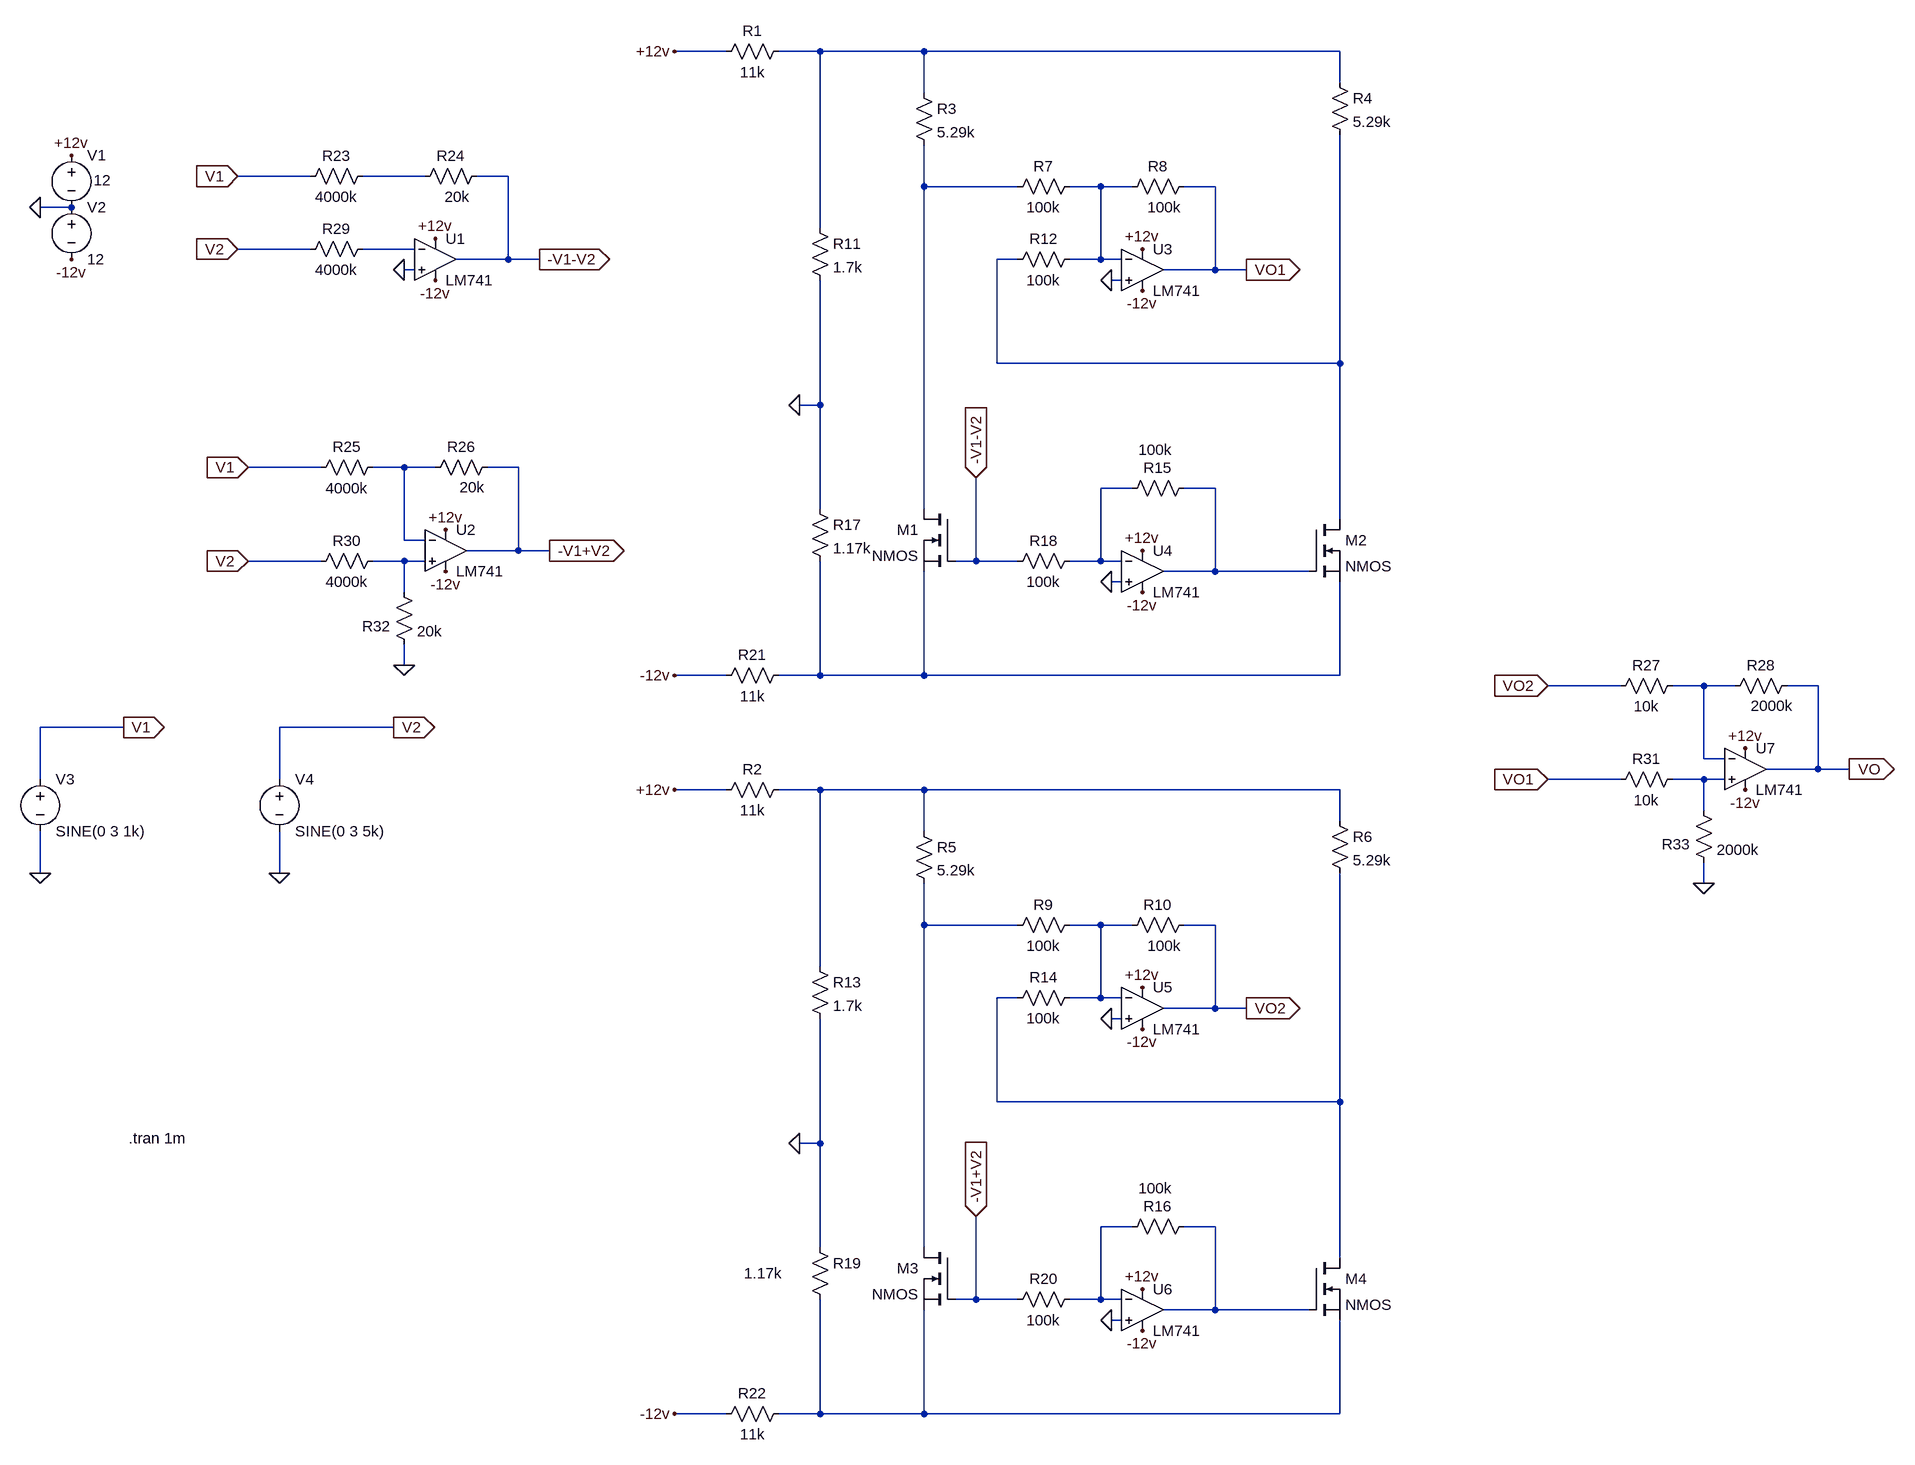
[diagram p0: schematic Multiplier_squaring.asc]
Multiplier_squaring.asc, the LTspice schematic file:
Version 4
SHEET 1 2468 1968
WIRE 592 -208 512 -208
WIRE 736 -208 672 -208
WIRE 896 -208 736 -208
WIRE 1536 -208 896 -208
WIRE 1536 -160 1536 -208
WIRE 896 -144 896 -208
WIRE -48 -16 -160 -16
WIRE 128 -16 32 -16
WIRE 256 -16 208 -16
WIRE 896 0 896 -64
WIRE 1040 0 896 0
WIRE 1168 0 1120 0
WIRE 1216 0 1168 0
WIRE 1344 0 1296 0
WIRE -416 32 -464 32
WIRE 736 64 736 -208
WIRE -48 96 -160 96
WIRE 112 96 32 96
WIRE 256 112 256 -16
WIRE 256 112 176 112
WIRE 304 112 256 112
WIRE 1040 112 1008 112
WIRE 1168 112 1168 0
WIRE 1168 112 1120 112
WIRE 1200 112 1168 112
WIRE 112 128 96 128
WIRE 1344 128 1344 0
WIRE 1344 128 1264 128
WIRE 1392 128 1344 128
WIRE 1200 144 1184 144
WIRE 1008 272 1008 112
WIRE 1536 272 1536 -80
WIRE 1536 272 1008 272
WIRE 736 336 736 144
WIRE 736 336 704 336
WIRE -32 432 -144 432
WIRE 96 432 48 432
WIRE 144 432 96 432
WIRE 272 432 224 432
WIRE 1216 464 1168 464
WIRE 1344 464 1296 464
WIRE 736 496 736 336
WIRE 896 496 896 0
WIRE 1536 512 1536 272
WIRE 96 544 96 432
WIRE 128 544 96 544
WIRE 272 560 272 432
WIRE 272 560 192 560
WIRE 320 560 272 560
WIRE -32 576 -144 576
WIRE 96 576 48 576
WIRE 128 576 96 576
WIRE 976 576 976 448
WIRE 976 576 944 576
WIRE 1040 576 976 576
WIRE 1168 576 1168 464
WIRE 1168 576 1120 576
WIRE 1200 576 1168 576
WIRE 1344 592 1344 464
WIRE 1344 592 1264 592
WIRE 1488 592 1344 592
WIRE 1200 608 1184 608
WIRE 96 624 96 576
WIRE 96 736 96 704
WIRE 592 752 512 752
WIRE 736 752 736 576
WIRE 736 752 672 752
WIRE 896 752 896 592
WIRE 896 752 736 752
WIRE 1536 752 1536 608
WIRE 1536 752 896 752
WIRE 1968 768 1856 768
WIRE 2096 768 2048 768
WIRE 2144 768 2096 768
WIRE 2272 768 2224 768
WIRE -336 832 -464 832
WIRE 80 832 -96 832
WIRE 2096 880 2096 768
WIRE 2128 880 2096 880
WIRE 2272 896 2272 768
WIRE 2272 896 2192 896
WIRE 2320 896 2272 896
WIRE -464 912 -464 832
WIRE -96 912 -96 832
WIRE 1968 912 1856 912
WIRE 2096 912 2048 912
WIRE 2128 912 2096 912
WIRE 592 928 512 928
WIRE 736 928 672 928
WIRE 896 928 736 928
WIRE 1536 928 896 928
WIRE 2096 960 2096 912
WIRE 1536 976 1536 928
WIRE 896 992 896 928
WIRE -464 1056 -464 992
WIRE -96 1056 -96 992
WIRE 2096 1072 2096 1040
WIRE 896 1136 896 1072
WIRE 1040 1136 896 1136
WIRE 1168 1136 1120 1136
WIRE 1216 1136 1168 1136
WIRE 1344 1136 1296 1136
WIRE 736 1200 736 928
WIRE 1040 1248 1008 1248
WIRE 1168 1248 1168 1136
WIRE 1168 1248 1120 1248
WIRE 1200 1248 1168 1248
WIRE 1344 1264 1344 1136
WIRE 1344 1264 1264 1264
WIRE 1392 1264 1344 1264
WIRE 1200 1280 1184 1280
WIRE 1008 1408 1008 1248
WIRE 1536 1408 1536 1056
WIRE 1536 1408 1008 1408
WIRE 736 1472 736 1280
WIRE 736 1472 704 1472
WIRE 1216 1600 1168 1600
WIRE 1344 1600 1296 1600
WIRE 736 1632 736 1472
WIRE 896 1632 896 1136
WIRE 1536 1648 1536 1408
WIRE 976 1712 976 1584
WIRE 976 1712 944 1712
WIRE 1040 1712 976 1712
WIRE 1168 1712 1168 1600
WIRE 1168 1712 1120 1712
WIRE 1200 1712 1168 1712
WIRE 1344 1728 1344 1600
WIRE 1344 1728 1264 1728
WIRE 1488 1728 1344 1728
WIRE 1200 1744 1184 1744
WIRE 592 1888 512 1888
WIRE 736 1888 736 1712
WIRE 736 1888 672 1888
WIRE 896 1888 896 1728
WIRE 896 1888 736 1888
WIRE 1536 1888 1536 1744
WIRE 1536 1888 896 1888
FLAG 96 128 0
FLAG -160 -16 V1
IOPIN -160 -16 In
FLAG -160 96 V2
IOPIN -160 96 In
FLAG -464 32 0
FLAG -416 -48 +12v
FLAG -416 112 -12v
FLAG 144 80 +12v
FLAG 144 144 -12v
FLAG -144 432 V1
IOPIN -144 432 In
FLAG -144 576 V2
IOPIN -144 576 In
FLAG 160 528 +12v
FLAG 160 592 -12v
FLAG 96 736 0
FLAG 1184 144 0
FLAG 1232 96 +12v
FLAG 1232 160 -12v
FLAG 1184 608 0
FLAG 1232 560 +12v
FLAG 1232 624 -12v
FLAG 1392 128 VO1
IOPIN 1392 128 Out
FLAG 704 336 0
FLAG 512 752 -12v
FLAG 512 -208 +12v
FLAG 304 112 -V1-V2
IOPIN 304 112 Out
FLAG 976 448 -V1-V2
IOPIN 976 448 In
FLAG 1184 1280 0
FLAG 1232 1232 +12v
FLAG 1232 1296 -12v
FLAG 1184 1744 0
FLAG 1232 1696 +12v
FLAG 1232 1760 -12v
FLAG 1392 1264 VO2
IOPIN 1392 1264 Out
FLAG 704 1472 0
FLAG 512 1888 -12v
FLAG 512 928 +12v
FLAG 976 1584 -V1+V2
IOPIN 976 1584 In
FLAG 320 560 -V1+V2
IOPIN 320 560 Out
FLAG 1856 768 VO2
IOPIN 1856 768 In
FLAG 1856 912 VO1
IOPIN 1856 912 In
FLAG 2160 864 +12v
FLAG 2160 928 -12v
FLAG 2096 1072 0
FLAG 2320 896 VO
IOPIN 2320 896 Out
FLAG -464 1056 0
FLAG -96 1056 0
FLAG 80 832 V2
IOPIN 80 832 Out
FLAG -336 832 V1
IOPIN -336 832 Out
SYMBOL OpAmps\\LM741 144 48 R0
SYMATTR InstName U1
SYMBOL res 224 -32 R90
WINDOW 0 0 56 VBottom 2
WINDOW 3 32 46 VTop 2
SYMATTR InstName R24
SYMATTR Value 20k
SYMBOL res 48 -32 R90
WINDOW 0 0 56 VBottom 2
WINDOW 3 32 56 VTop 2
SYMATTR InstName R23
SYMATTR Value 4000k
SYMBOL res 48 80 R90
WINDOW 0 0 56 VBottom 2
WINDOW 3 32 56 VTop 2
SYMATTR InstName R29
SYMATTR Value 4000k
SYMBOL voltage -416 -64 R0
WINDOW 123 0 0 Left 0
WINDOW 39 0 0 Left 0
WINDOW 3 34 54 Left 2
SYMATTR Value 12
SYMATTR InstName V1
SYMBOL voltage -416 16 R0
WINDOW 123 0 0 Left 0
WINDOW 39 0 0 Left 0
SYMATTR InstName V2
SYMATTR Value 12
SYMBOL OpAmps\\LM741 160 496 R0
SYMATTR InstName U2
SYMBOL res 240 416 R90
WINDOW 0 0 56 VBottom 2
WINDOW 3 31 39 VTop 2
SYMATTR InstName R26
SYMATTR Value 20k
SYMBOL res 64 416 R90
WINDOW 0 0 56 VBottom 2
WINDOW 3 32 56 VTop 2
SYMATTR InstName R25
SYMATTR Value 4000k
SYMBOL res 64 560 R90
WINDOW 0 0 56 VBottom 2
WINDOW 3 32 56 VTop 2
SYMATTR InstName R30
SYMATTR Value 4000k
SYMBOL res 80 608 R0
WINDOW 0 -49 68 Left 2
SYMATTR InstName R32
SYMATTR Value 20k
SYMBOL OpAmps\\LM741 1232 64 R0
SYMATTR InstName U3
SYMBOL res 1312 -16 R90
WINDOW 0 0 56 VBottom 2
WINDOW 3 32 46 VTop 2
SYMATTR InstName R8
SYMATTR Value 100k
SYMBOL res 1136 -16 R90
WINDOW 0 0 56 VBottom 2
WINDOW 3 32 56 VTop 2
SYMATTR InstName R7
SYMATTR Value 100k
SYMBOL res 1136 96 R90
WINDOW 0 0 56 VBottom 2
WINDOW 3 32 56 VTop 2
SYMATTR InstName R12
SYMATTR Value 100k
SYMBOL res 1520 -176 R0
SYMATTR InstName R4
SYMATTR Value 5.29k
SYMBOL res 688 -224 R90
WINDOW 0 0 56 VBottom 2
WINDOW 3 32 56 VTop 2
SYMATTR InstName R1
SYMATTR Value 11k
SYMBOL res 880 -160 R0
SYMATTR InstName R3
SYMATTR Value 5.29k
SYMBOL res 720 48 R0
SYMATTR InstName R11
SYMATTR Value 1.7k
SYMBOL OpAmps\\LM741 1232 528 R0
SYMATTR InstName U4
SYMBOL res 1312 448 R90
WINDOW 0 0 56 VBottom 2
WINDOW 3 -59 60 VTop 2
SYMATTR InstName R15
SYMATTR Value 100k
SYMBOL res 1136 560 R90
WINDOW 0 0 56 VBottom 2
WINDOW 3 32 56 VTop 2
SYMATTR InstName R18
SYMATTR Value 100k
SYMBOL nmos 944 496 M0
SYMATTR InstName M1
SYMBOL nmos 1488 512 R0
SYMATTR InstName M2
SYMBOL res 688 736 R90
WINDOW 0 0 56 VBottom 2
WINDOW 3 32 56 VTop 2
SYMATTR InstName R21
SYMATTR Value 11k
SYMBOL OpAmps\\LM741 1232 1200 R0
SYMATTR InstName U5
SYMBOL res 1312 1120 R90
WINDOW 0 0 56 VBottom 2
WINDOW 3 32 46 VTop 2
SYMATTR InstName R10
SYMATTR Value 100k
SYMBOL res 1136 1120 R90
WINDOW 0 0 56 VBottom 2
WINDOW 3 32 56 VTop 2
SYMATTR InstName R9
SYMATTR Value 100k
SYMBOL res 1136 1232 R90
WINDOW 0 0 56 VBottom 2
WINDOW 3 32 56 VTop 2
SYMATTR InstName R14
SYMATTR Value 100k
SYMBOL res 1520 960 R0
SYMATTR InstName R6
SYMATTR Value 5.29k
SYMBOL res 688 912 R90
WINDOW 0 0 56 VBottom 2
WINDOW 3 32 56 VTop 2
SYMATTR InstName R2
SYMATTR Value 11k
SYMBOL res 880 976 R0
SYMATTR InstName R5
SYMATTR Value 5.29k
SYMBOL res 720 1184 R0
SYMATTR InstName R13
SYMATTR Value 1.7k
SYMBOL OpAmps\\LM741 1232 1664 R0
SYMATTR InstName U6
SYMBOL res 1312 1584 R90
WINDOW 0 0 56 VBottom 2
WINDOW 3 -59 60 VTop 2
SYMATTR InstName R16
SYMATTR Value 100k
SYMBOL res 1136 1696 R90
WINDOW 0 0 56 VBottom 2
WINDOW 3 32 56 VTop 2
SYMATTR InstName R20
SYMATTR Value 100k
SYMBOL nmos 944 1632 M0
SYMATTR InstName M3
SYMBOL nmos 1488 1648 R0
SYMATTR InstName M4
SYMBOL res 688 1872 R90
WINDOW 0 0 56 VBottom 2
WINDOW 3 32 56 VTop 2
SYMATTR InstName R22
SYMATTR Value 11k
SYMBOL res 720 1616 R0
WINDOW 3 -101 56 Left 2
SYMATTR InstName R19
SYMATTR Value 1.17k
SYMBOL res 720 480 R0
SYMATTR InstName R17
SYMATTR Value 1.17k
SYMBOL OpAmps\\LM741 2160 832 R0
SYMATTR InstName U7
SYMBOL res 2240 752 R90
WINDOW 0 0 56 VBottom 2
WINDOW 3 31 39 VTop 2
SYMATTR InstName R28
SYMATTR Value 2000k
SYMBOL res 2064 752 R90
WINDOW 0 0 56 VBottom 2
WINDOW 3 32 56 VTop 2
SYMATTR InstName R27
SYMATTR Value 10k
SYMBOL res 2064 896 R90
WINDOW 0 0 56 VBottom 2
WINDOW 3 32 56 VTop 2
SYMATTR InstName R31
SYMATTR Value 10k
SYMBOL res 2080 944 R0
WINDOW 0 -49 68 Left 2
SYMATTR InstName R33
SYMATTR Value 2000k
SYMBOL voltage -464 896 R0
WINDOW 123 0 0 Left 0
WINDOW 39 0 0 Left 0
SYMATTR InstName V3
SYMATTR Value SINE(0 3 1k)
SYMBOL voltage -96 896 R0
WINDOW 123 0 0 Left 0
WINDOW 39 0 0 Left 0
SYMATTR InstName V4
SYMATTR Value SINE(0 3 5k)
TEXT -328 1464 Left 2 !.tran 1m

The netlist it stands for:
* Multiplier_squaring.asc
XU1 0 N005 +12v -12v -V1-V2 LM741  ; pins In+ In- V+ V- OUT
R24 -V1-V2 N002 20k
R23 N002 V1 4000k
R29 N005 V2 4000k
V1 +12v 0 12
V2 0 -12v 12
XU2 N010 N007 +12v -12v -V1+V2 LM741  ; pins In+ In- V+ V- OUT
R26 -V1+V2 N007 20k
R25 N007 V1 4000k
R30 N010 V2 4000k
R32 N010 0 20k
XU3 0 N004 +12v -12v VO1 LM741  ; pins In+ In- V+ V- OUT
R8 VO1 N004 100k
R7 N004 N003 100k
R12 N004 N006 100k
R4 N001 N006 5.29k
R1 N001 +12v 11k
R3 N001 N003 5.29k
R11 N001 0 1.7k
XU4 0 N008 +12v -12v N009 LM741  ; pins In+ In- V+ V- OUT
R15 N009 N008 100k
R18 N008 -V1-V2 100k
M1 N003 -V1-V2 N011 N011 NMOS
M2 N006 N009 N011 N011 NMOS
R21 N011 -12v 11k
XU5 0 N016 +12v -12v VO2 LM741  ; pins In+ In- V+ V- OUT
R10 VO2 N016 100k
R9 N016 N015 100k
R14 N016 N017 100k
R6 N014 N017 5.29k
R2 N014 +12v 11k
R5 N014 N015 5.29k
R13 N014 0 1.7k
XU6 0 N018 +12v -12v N019 LM741  ; pins In+ In- V+ V- OUT
R16 N019 N018 100k
R20 N018 -V1+V2 100k
M3 N015 -V1+V2 N020 N020 NMOS
M4 N017 N019 N020 N020 NMOS
R22 N020 -12v 11k
R19 0 N020 1.17k
R17 0 N011 1.17k
XU7 N013 N012 +12v -12v VO LM741  ; pins In+ In- V+ V- OUT
R28 VO N012 2000k
R27 N012 VO2 10k
R31 N013 VO1 10k
R33 N013 0 2000k
V3 V1 0 SINE(0 3 1k)
V4 V2 0 SINE(0 3 5k)
.model NMOS NMOS
.model PMOS PMOS
.lib standard.mos
.tran 1m
.lib LM741.lib
.backanno
.end